# EAGLE design RaspiComm_v3 (EAGLE 6.2)
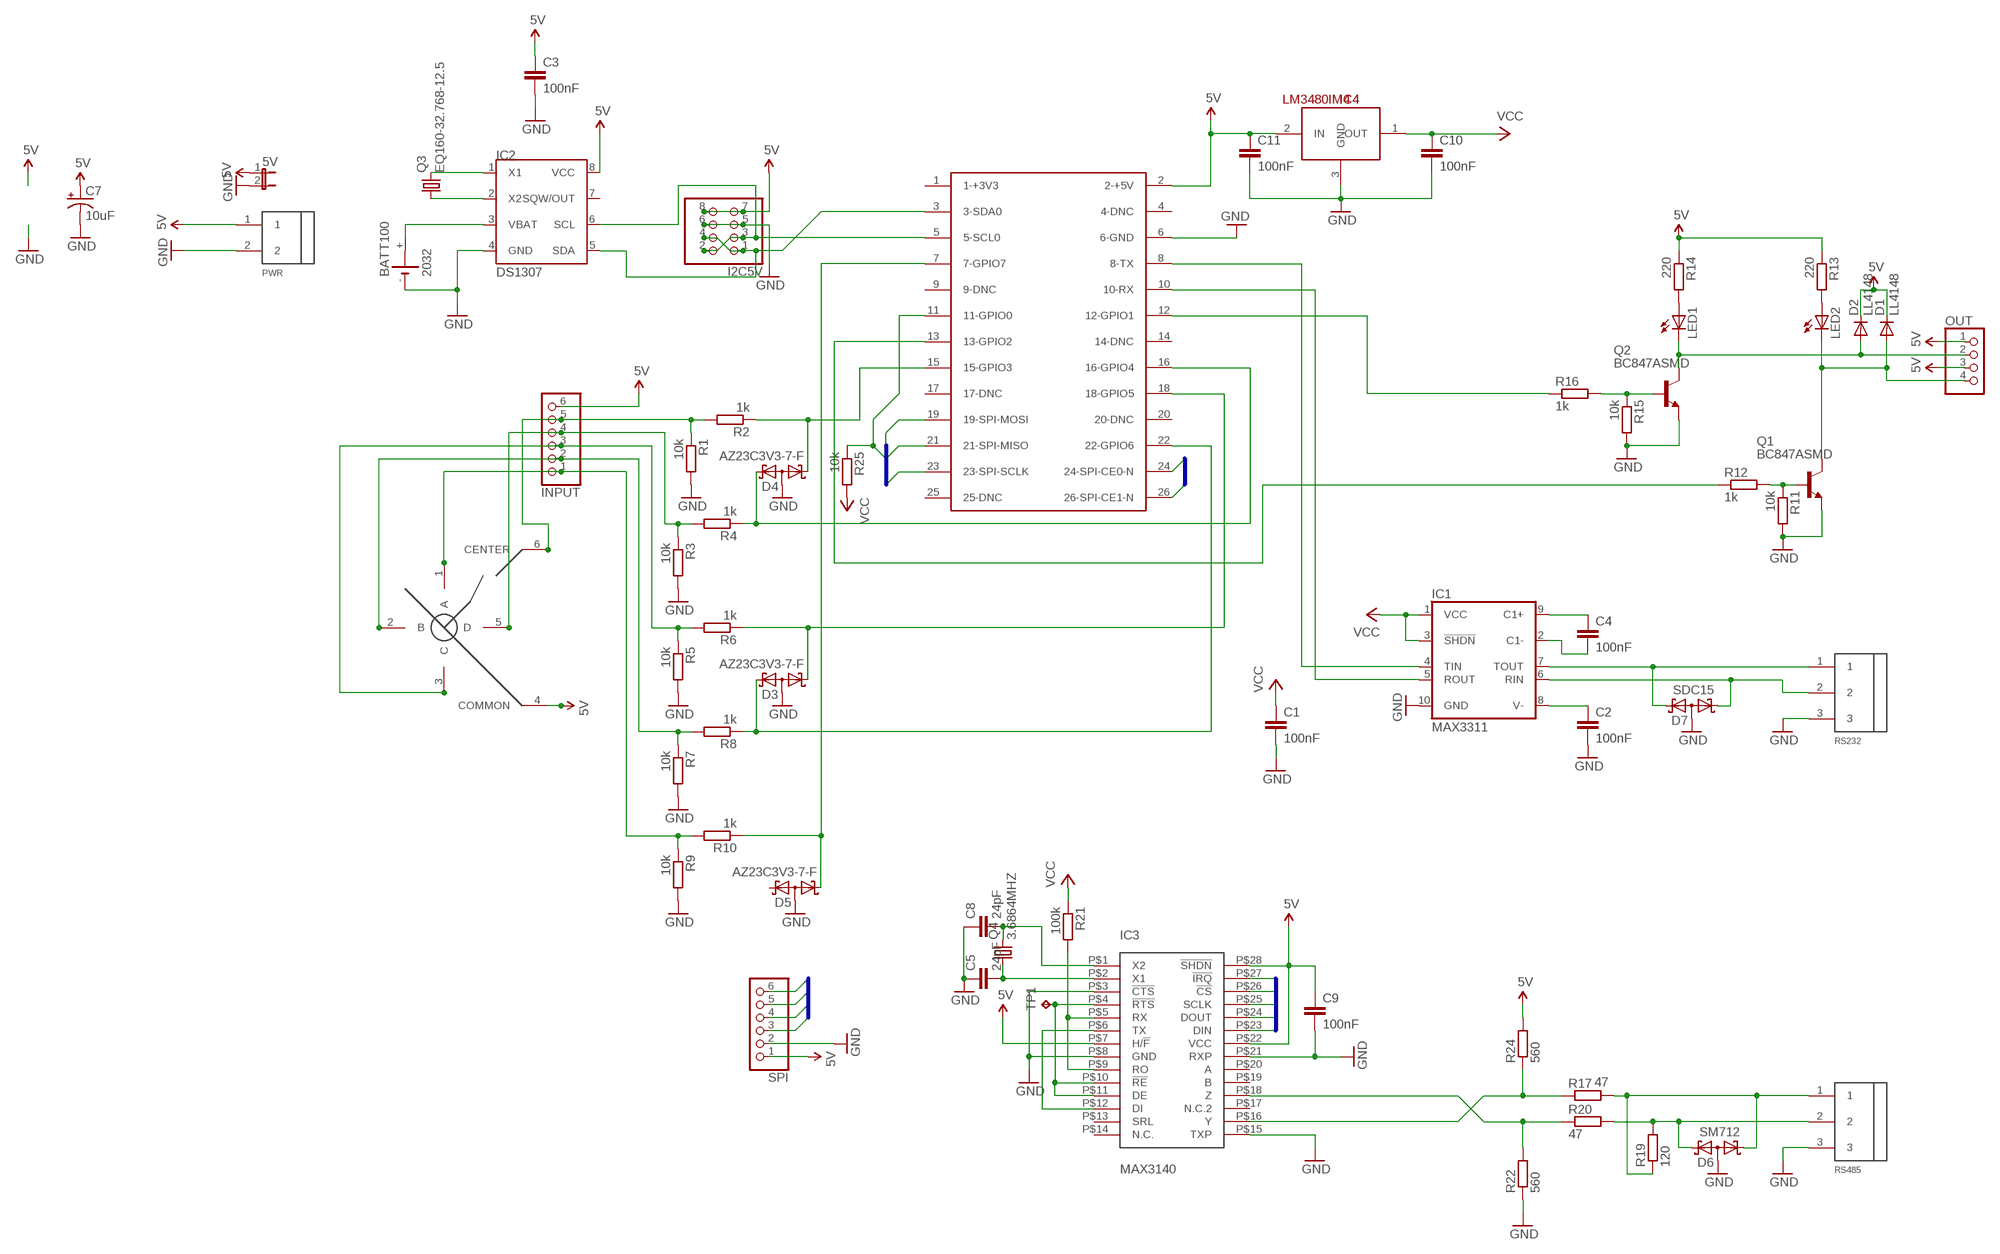
[diagram p0: schematic, sheet 1]

## Parts
5V  JP1E  [JP1]
BATT100  2032  [KZH20SMD]
C1  100nF  C-EUC0603  [C0603]
C2  100nF  C-EUC0603  [C0603]
C3  100nF  C-EUC0603  [C0603]
C4  100nF  C-EUC0603  [C0603]
C5  24pF  C-EUC0603  [C0603]
C7  10uF  293DB  [B(3528-21)]
C8  24pF  C-EUC0603  [C0603]
C9  100nF  C-EUC0603  [C0603]
C10  100nF  C-EUC0603  [C0603]
C11  100nF  C-EUC0603  [C0603]
D1  LL4148  DIODE-SOD80C  [SOD80C]
D2  LL4148  DIODE-SOD80C  [SOD80C]
D3  AZ23C3V3-7-F  AZ23CXXX  [SOT23]
D4  AZ23C3V3-7-F  AZ23CXXX  [SOT23]
D5  AZ23C3V3-7-F  AZ23CXXX  [SOT23]
D6  SM712  AZ23CXXX  [SOT23]
D7  SDC15  AZ23CXXX  [SOT23]
I2C5V  PINHD-2X4_2.54-SMD  [2X04SMD]
IC1  MAX3311  [UMAX10]
IC2  DS1307  [SOIC-8]
IC3  MAX3140  [QSOP28]
IC4  LM3480IM4  [SOT23-3]
INPUT  PINHD-1X6_2.00  [1X06M]
LED1  LEDSML0805  [SML0805]
LED2  LEDSML0805  [SML0805]
OUT  PINHD-1X4_2.00  [1X04M]
PWR  31182102  [31182102]
Q1  BC847ASMD  [SOT23]
Q2  BC847ASMD  [SOT23]
Q3  EQ160-32.768-12.5  EQ160  [EQ160]
Q4  3.6864MHZ  QUARTZ49USMX  [49USMX]
R1  10k  R-EU_R0603  [R0603]
R2  1k  R-EU_R0603  [R0603]
R3  10k  R-EU_R0603  [R0603]
R4  1k  R-EU_R0603  [R0603]
R5  10k  R-EU_R0603  [R0603]
R6  1k  R-EU_R0603  [R0603]
R7  10k  R-EU_R0603  [R0603]
R8  1k  R-EU_R0603  [R0603]
R9  10k  R-EU_R0603  [R0603]
R10  1k  R-EU_R0603  [R0603]
R11  10k  R-EU_R0603  [R0603]
R12  1k  R-EU_R0603  [R0603]
R13  220  R-EU_R0603  [R0603]
R14  220  R-EU_R0603  [R0603]
R15  10k  R-EU_R0603  [R0603]
R16  1k  R-EU_R0603  [R0603]
R17  47  R-EU_R1206  [R1206]
R19  120  R-EU_R1206  [R1206]
R20  47  R-EU_R1206  [R1206]
R21  100k  R-EU_R0603  [R0603]
R22  560  R-EU_R0603  [R0603]
R24  560  R-EU_R0603  [R0603]
R25  10k  R-EU_R0603  [R0603]
RS232  31182103  [31182103]
RS485  31182103  [31182103]
SPI  PINHD-1X6_2.00  [1X06M]
SW1  SKQUDBE010  SKQUSMD  [SKQU-SMD]
TP1  TPB1,27  [B1,27]
U$7  RASPBERRY-PIHEADER  [RASPI_GPIO_HEADER]

## Nets
5V: 5V.1 C3.1 C7.+ C9.1 C11.1 D1.C D2.C I2C5V.7 I2C5V.8 IC2.8(VCC) IC3.P$7(H/!F) IC3.P$22(VCC) IC3.P$28(!SHDN) IC4.2(IN) INPUT.6 OUT.1 OUT.3 PWR.1 R13.1 R14.1 R24.2 SPI.1 SW1.4(COMMON) U$7.2(2-+5V)
CS1: IC3.P$26(!CS) U$7.24(24-SPI-CE0-N)
CS2: SPI.3 U$7.26(26-SPI-CE1-N)
GND: 5V.2 BATT100.- C1.2 C2.2 C3.2 C5.1 C7.- C8.1 C9.2 C10.2 C11.2 D3.3(AA) D4.3(AA) D5.3(AA) D6.3(AA) D7.3(AA) I2C5V.5 I2C5V.6 IC1.10(GND) IC2.4(GND) IC3.P$3(!CTS) IC3.P$8(GND) IC3.P$15(TXP) IC3.P$21(RXP) IC4.3(GND) PWR.2 Q1.2(E) Q2.2(E) R1.2 R3.2 R5.2 R7.2 R9.2 R11.2 R15.2 R22.1 RS232.3 RS485.3 SPI.2 U$7.6(6-GND)
IRQ: IC3.P$27(!IRQ) R25.1 U$7.11(11-GPIO0)
MISO: IC3.P$24(DOUT) SPI.5 U$7.21(21-SPI-MISO)
MOSI: IC3.P$23(DIN) SPI.6 U$7.19(19-SPI-MOSI)
N$1: R16.1 U$7.12(12-GPIO1)
N$2: C5.2 IC3.P$2(X1) Q4.P$1
N$3: IC3.P$5(RX) IC3.P$9(RO) R21.2
N$4: IC2.1(X1) Q3.P$2
N$5: IC3.P$16(Y) R17.1 R24.1
N$6: IC3.P$18(Z) R20.1 R22.2
N$7: I2C5V.2 I2C5V.3 IC2.6(SCL) U$7.5(5-SCL0)
N$8: INPUT.5 R1.1 R2.2 SW1.6(CENTER)
N$9: IC3.P$4(!RTS) IC3.P$10(!RE) IC3.P$11(DE) TP1.TP
N$10: INPUT.4 R3.1 R4.2 SW1.5(D)
N$13: INPUT.3 R5.1 R6.2 SW1.3(C)
N$14: INPUT.2 R7.1 R8.2 SW1.2(B)
N$15: INPUT.1 R9.1 R10.2 SW1.1(A)
N$16: D4.1(K1) R2.1 U$7.15(15-GPIO3)
N$17: D4.2(K2) R4.1 U$7.16(16-GPIO4)
N$18: D3.1(K1) R6.1 U$7.18(18-GPIO5)
N$19: D3.2(K2) R8.1 U$7.22(22-GPIO6)
N$20: D5.1(K1) R10.1 U$7.7(7-GPIO7)
N$21: D6.2(K2) R19.2 R20.2 RS485.2
N$22: C2.1 IC1.8(V-)
N$23: C4.2 IC1.2(C1-)
N$24: C4.1 IC1.9(C1+)
N$25: D6.1(K1) R17.2 R19.1 RS485.1
N$27: LED1.A R14.2
N$28: D7.2(K2) IC1.7(TOUT) RS232.1
N$29: D7.1(K1) IC1.6(RIN) RS232.2
N$30: C8.2 IC3.P$1(X2) Q4.P$2
N$31: LED2.A R13.2
N$32: D1.A LED2.C OUT.4 Q1.3(C)
N$33: I2C5V.1 I2C5V.4 IC2.5(SDA) U$7.3(3-SDA0)
N$34: D2.A LED1.C OUT.2 Q2.3(C)
N$35: IC2.2(X2) Q3.P$1
N$37: Q2.1(B) R15.1 R16.2
N$38: Q1.1(B) R11.1 R12.2
N$39: BATT100.+ IC2.3(VBAT)
N$40: IC3.P$6(TX) IC3.P$12(DI)
N$41: R12.1 U$7.13(13-GPIO2)
RX: IC1.5(ROUT) U$7.10(10-RX)
SCLK: IC3.P$25(SCLK) SPI.4 U$7.23(23-SPI-SCLK)
TX: IC1.4(TIN) U$7.8(8-TX)
VCC: C1.1 C10.1 IC1.1(VCC) IC1.3(!SHDN) IC4.1(OUT) R21.1 R25.2
Unconnected: D5.2(K2) IC2.7(SQW/OUT) IC3.P$13(SRL) IC3.P$14(N.C.) IC3.P$17(N.C.2) IC3.P$19(B) IC3.P$20(A) U$7.1(1-+3V3) U$7.4(4-DNC) U$7.9(9-DNC) U$7.14(14-DNC) U$7.17(17-DNC) U$7.20(20-DNC) U$7.25(25-DNC)

## Buses
SPI:IRQ,CS1,CS2,SCLK,MISO,MOSI

## Library data of the parts
5V = jumper:JP1E: JUMPER
BATT100 = kzh20_lithium_batterie_holder:2032
C1-C5 C8-C11 = rcl:C-EU: CAPACITOR, European symbol
C7 = vishay:293D
D1 D2 = diode:DIODE-: DIODE
D3-D7 = diode:AZ23CXXX: Dual-Zener Diode
I2C5V = pinhead:PINHD-2X4: PIN HEADER
IC1 = maxim:MAX3311: 460kbps, 1µA Supply Current, RS-232-Compatible Transceivers in µMAX Source: http://www.maxim-ic.com .. MAX3311-MAX3313.pdf; MF: MAXIM; MPN: MAX3311ECUB+; OC_FARNELL: 1379937; OC_NEWARK: 67K4953
IC2 = dallas:DS1307: I2C Serial RTC w/56 bytes battery backed RAM
IC3 = max3140:MAX3140
IC4 = SparkFun:LM3480IM4
INPUT SPI = pinhead:PINHD-1X6: PIN HEADER
LED1 LED2 = led:LED: LED OSRAM: - CHIPLED LG R971, LG N971, LY N971, LG Q971, LY Q971, LO R971, LY R971 LH N974, LH R974 LS Q976, LO Q976, LY Q976 LO Q996 - Hyper CHIPLED LW Q18S LB Q993, LB Q99A, LB R99A - SideLED LS A670, LO A670, LY A670, LG A670, LP A670 LB A673, LV A673, LT A673, LW A673 LH A674 LY A675 LS A676, LA A676, LO A676, LY A676, LW A676 LS A679, LY A679, LG A679 - Hyper Micro SIDELED® LS Y876, LA Y876, LO Y876, LY Y876 LT Y87S - SmartLED LW L88C, LW L88S LB L89C, LB L89S, LG L890 LS L89K, LO L89K, LY L89K LS L896, LA L896, LO L896, LY L896 - TOPLED LS T670, LO T670, LY T670, LG T670, LP T670 LSG T670, LSP T670, LSY T670, LOP T670, LYG T670 LG T671, LOG T671, LSG T671 LB T673, LV T673, LT T673, LW T673 LH T674 LS T676, LA T676, LO T676, LY T676, LB T676, LH T676, LSB T676, LW T676 LB T67C, LV T67C, LT T67C, LS T67K, LO T67K, LY T67K, LW E67C LS E67B, LA E67B, LO E67B, LY E67B, LB E67C, LV E67C, LT E67C LW T67C LS T679, LY T679, LG T679 LS T770, LO T770, LY T770, LG T770, LP T770 LB T773, LV T773, LT T773, LW T773 LH T774 LS E675, LA E675, LY E675, LS T675 LS T776, LA T776, LO T776, LY T776, LB T776 LHGB T686 LT T68C, LB T68C - Hyper Mini TOPLED® LB M676 - Mini TOPLED Santana® LG M470 LS M47K, LO M47K, LY M47K Source: http://www.osram.convergy.de LUXEON: - LUMILED® LXK2-PW12-R00, LXK2-PW12-S00, LXK2-PW14-U00, LXK2-PW14-V00 LXK2-PM12-R00, LXK2-PM12-S00, LXK2-PM14-U00 LXK2-PE12-Q00, LXK2-PE12-R00, LXK2-PE12-S00, LXK2-PE14-T00, LXK2-PE14-U00 LXK2-PB12-K00, LXK2-PB12-L00, LXK2-PB12-M00, LXK2-PB14-N00, LXK2-PB14-P00, LXK2-PB14-Q00 LXK2-PR12-L00, LXK2-PR12-M00, LXK2-PR14-Q00, LXK2-PR14-R00 LXK2-PD12-Q00, LXK2-PD12-R00, LXK2-PD12-S00 LXK2-PH12-R00, LXK2-PH12-S00 LXK2-PL12-P00, LXK2-PL12-Q00, LXK2-PL12-R00 Source: www.luxeon.com KINGBRIGHT: KA-3528ASYC Source: www.kingbright.com
OUT = pinhead:PINHD-1X4: PIN HEADER
PWR = ria:31182102
Q1 Q2 = transistor-npn:BC847*: NPN Transistor
Q3 = EuroQuartz:EQ160
Q4 = EuroQuartz:QUARTZ
R1-R17 R19-R22 R24 R25 = rcl:R-EU_: RESISTOR, European symbol
RS232 RS485 = ria:31182103
SW1 = alps:SKQU
TP1 = testpad:TP: Test pad
U$7 = RaspberryPi:RASPBERRY-PI: Raspberry Pi Board <http://www.raspberrypi.org/> Jacques Lagnel V1.0 (beta) 2012 Board dimension: Forum 3D model <http://www.raspberrypi.org/forum/general-discussion/mechanical-profile-3d-models?value=3d%20model&type=1&include=1&search=1&ret=all> The GPIO Connector (P1): http://elinux.org/RPi_Low-level_peripherals

## Board
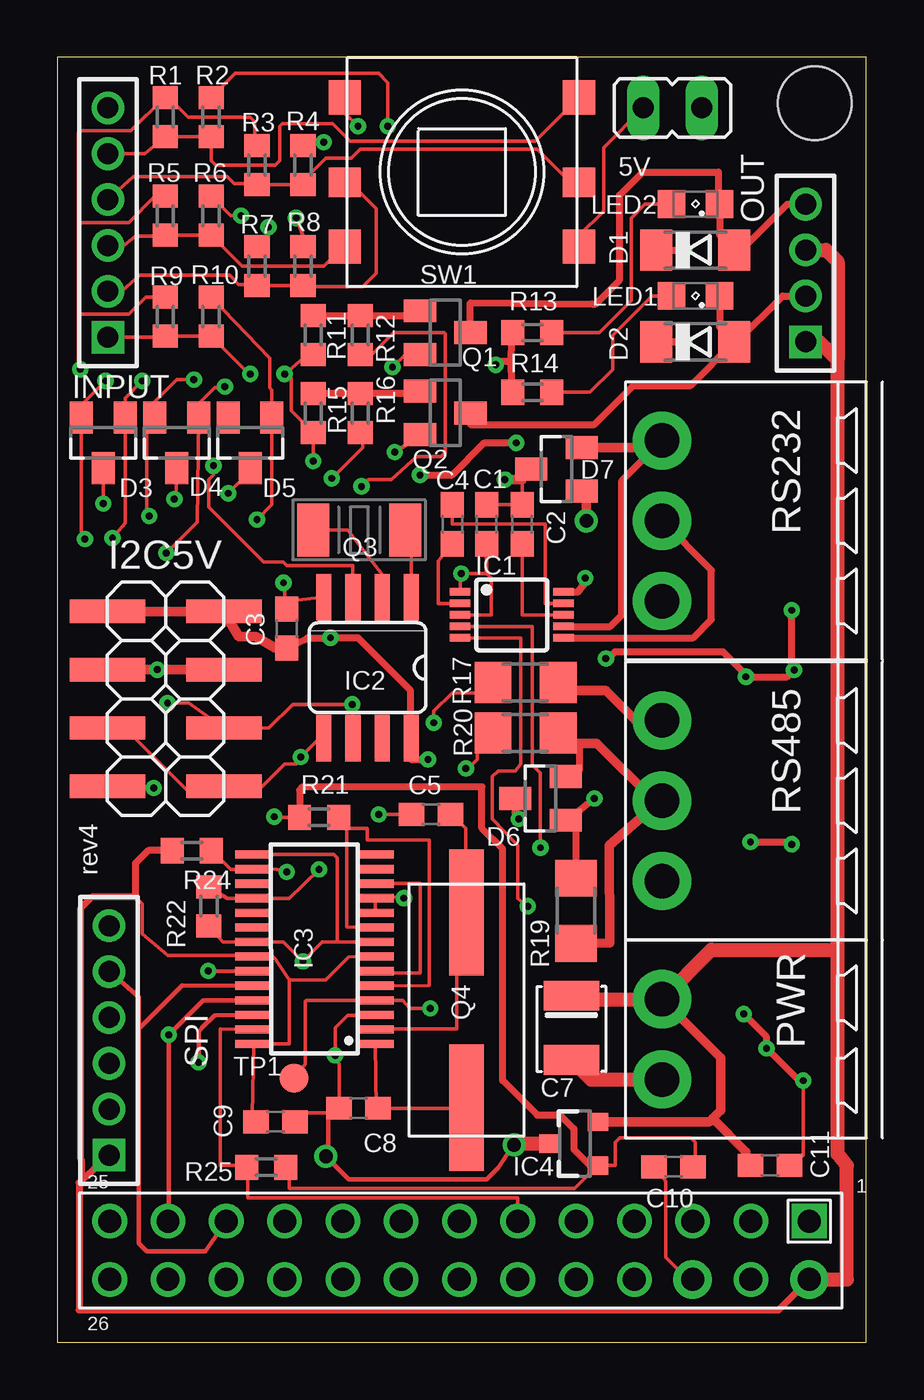
[diagram p1: board, top side]
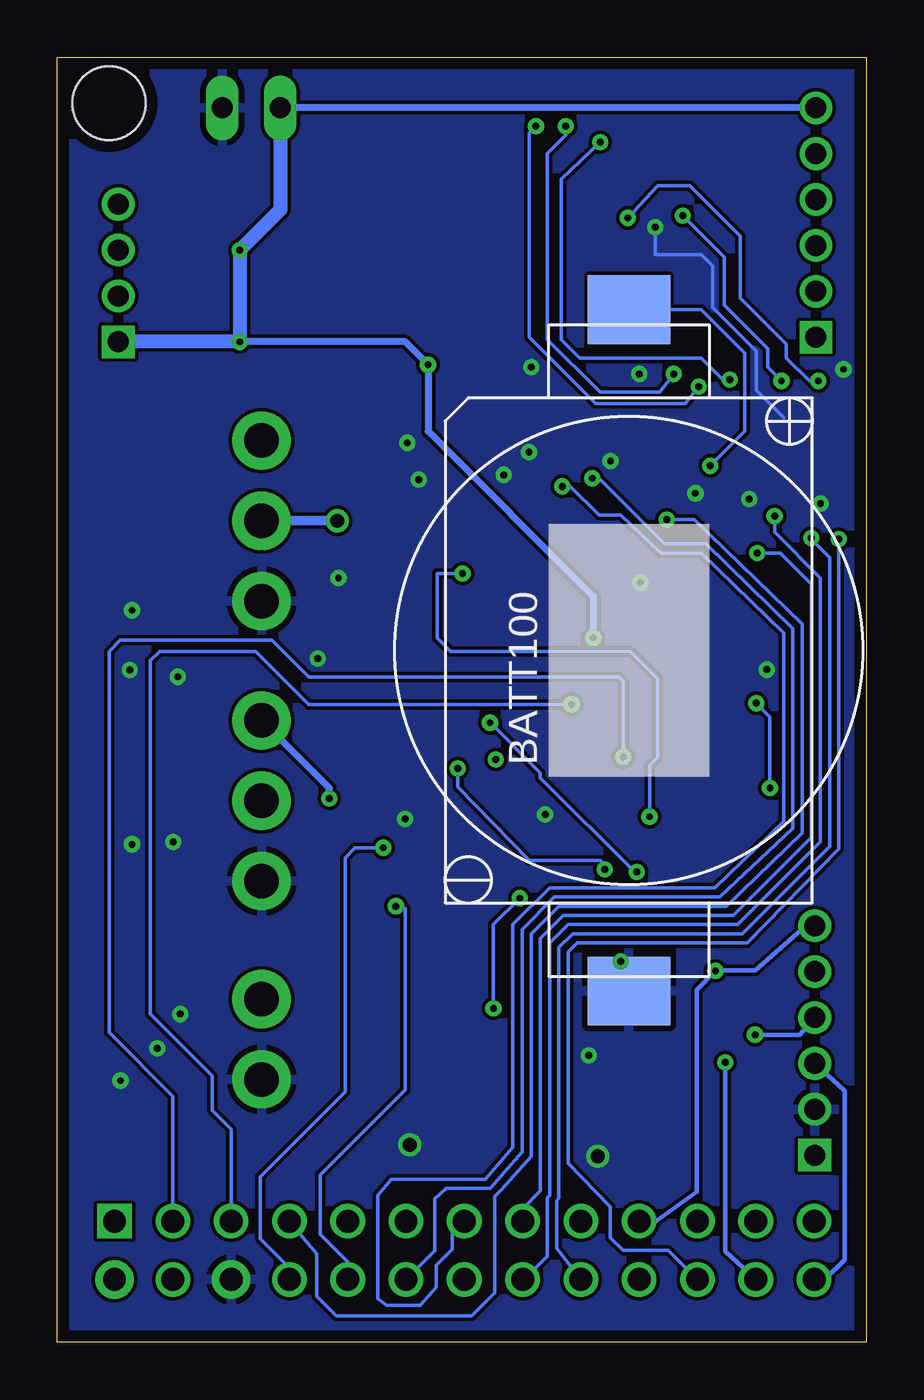
[diagram p2: board, bottom side, seen from below]

Size 35.25 x 56 mm. Coordinates in mm from the lower left corner, seen from the top.
Outline: 0,0 35.25,0 35.25,56 0,56 0,0
Copper layers (1*16): Top 0.035mm / dielectric 1.5mm / Bottom 0.035mm
Design rules: minimum track width 6mil, minimum drill 11mil, track to track 6mil, track to pad 6mil, pad to pad 6mil, via to via 6mil, smd to smd 0mil, copper to edge 20mil, drill to drill 8mil, minimum pad ring 10mil, minimum via ring 8mil, stop-mask expansion 4mil, vias tented up to drill 0mil, thermal gap 10mil
Holes 3.2 mm at 33,54

### Footprints (pad centres in the part's own frame; a part is rotated, then mirrored left to right if it is on the bottom)
JP1 = drill 0.914 long: 1 0,-1.27; 2 0,1.27
KZH20SMD = smd 3 x 3.6: + 14.85,0; - -14.85,0
C0603 = smd 1.1 x 1: 1 -0.85,0; 2 0.85,0
B(3528-21) = smd 1.3 x 2.4: + 1.4,0; - -1.4,0
SOD80C = smd 1.4 x 1.8: A 1.7,0; C -1.7,0
SOT23 = smd 1 x 1.4: 1 -0.95,-1.1; 2 0.95,-1.1; 3 0,1.1
2X04SMD = smd 1.016 x 3.302: 1 -1.27,-3.81; 2 -1.27,1.27; 3 1.27,-3.81; 4 1.27,1.27; 5 3.81,-3.81; 6 3.81,1.27; 7 6.35,-3.81; 8 6.35,1.27
UMAX10 = smd 0.32 x 0.9: 1 -1,-2.25; 2 -0.5,-2.25; 3 0,-2.25; 4 0.5,-2.25; 5 1,-2.25; 6 1,2.25; 7 0.5,2.25; 8 0,2.25; 9 -0.5,2.25; 10 -1,2.25
SOIC-8 = smd 2.032 x 0.66: 1 -3.073,1.27; 2 -3.073,0; 3 -3.073,-1.27; 4 -3.073,-2.54; 5 3.073,-2.54; 6 3.073,-1.27; 7 3.073,0; 8 3.073,1.27
QSOP28 = smd 0.356 x 1.6: P$1 -4.128,-2.655; P$2 -3.493,-2.655; P$3 -2.857,-2.655; P$4 -2.223,-2.655; P$5 -1.587,-2.655; P$6 -0.953,-2.655; P$7 -0.318,-2.655; P$8 0.318,-2.655; P$9 0.953,-2.655; P$10 1.587,-2.655; P$11 2.223,-2.655; P$12 2.857,-2.655; P$13 3.493,-2.655; P$14 4.128,-2.655; P$15 4.128,2.655; P$16 3.493,2.655; P$17 2.857,2.655; P$18 2.223,2.655; P$19 1.587,2.655; P$20 0.953,2.655; P$21 0.318,2.655; P$22 -0.318,2.655; P$23 -0.953,2.655; P$24 -1.587,2.655; P$25 -2.223,2.655; P$26 -2.857,2.655; P$27 -3.493,2.655; P$28 -4.128,2.655
SOT23-3 = smd 0.8 x 0.9: 1 -0.95,-1; 2 0.95,-1; 3 0,1.1
1X06M = drill 0.914 square: 1 -5,0 | drill 0.914: 2 -3,0; 3 -1,0; 4 1,0; 5 3,0; 6 5,0
SML0805 = smd 1.2 x 1.2: A 1.05,0; C -1.05,0
1X04M = drill 0.914 square: 1 -3,0 | drill 0.914: 2 -1,0; 3 1,0; 4 3,0
31182102 = drill 1.5 pad 2.54: 1 -1.75,-3.65; 2 1.75,-3.65
EQ160 = smd 1.4 x 2.3: P$1 -2,0; P$2 2,0
49USMX = smd 5.5 x 1.5: P$1 -4.25,0; P$2 4.25,0
R0603 = smd 1 x 1.1: 1 -0.85,0; 2 0.85,0
R1206 = smd 1.6 x 1.803: 1 -1.422,0; 2 1.422,0
31182103 = drill 1.5 pad 2.54: 1 -3.5,-3.65; 2 0,-3.65; 3 3.5,-3.65
SKQU-SMD = smd 1.4 x 1.5: 1 -5.1,3.25; 3 -5.1,-3.25; 4 5.1,-3.25; 6 5.1,3.25 | smd 1.4 x 1.3: 2 -5.1,-0.45; 5 5.1,-0.45
B1,27 = smd 1.27 x 1.27: TP 0,0
RASPI_GPIO_HEADER = drill 1 square: 1 -16.51,-1.27 | drill 1 pad 1.676: 2 -16.51,1.27; 6 -11.43,1.27 | drill 1: 3 -13.97,-1.27; 4 -13.97,1.27; 5 -11.43,-1.27; 7 -8.89,-1.27; 8 -8.89,1.27; 9 -6.35,-1.27; 10 -6.35,1.27; 11 -3.81,-1.27; 12 -3.81,1.27; 13 -1.27,-1.27; 14 -1.27,1.27; 15 1.27,-1.27; 16 1.27,1.27; 17 3.81,-1.27; 18 3.81,1.27; 19 6.35,-1.27; 20 6.35,1.27; 21 8.89,-1.27; 22 8.89,1.27; 23 11.43,-1.27; 24 11.43,1.27; 25 13.97,-1.27; 26 13.97,1.27

### Placement (x,y rotation side)
5V  26.8,53.8 270 top
BATT100  10.35,30.15 90 bottom
C1  18.7,35.65 90 top
C2  20.25,35.65 90 top
C3  10,31.1 90 top
C4  17.2,35.65 270 top
C5  16.27,23 0 top
C7  22.4,13.7 90 top
C8  13.12,10.2 0 top
C9  9.5,9.6 0 top
C10  26.85,7.65 180 top
C11  31.05,7.7 0 top
D1  27.8,47.6 0 top
D2  27.8,43.6 0 top
D3  2,39.2 180 top
D4  5.2,39.2 180 top
D5  8.4,39.2 180 top
D6  21.05,23.7 90 top
D7  21.75,38.05 90 top
I2C5V  3.45,25.5 90 top
IC1  19.8,31.7 270 top
IC2  14.15,29.4 270 top
IC3  11.2,17.12 90 top
IC4  22.55,8.65 90 top
INPUT  2.2,48.8 90 top
LED1  27.8,45.6 180 top
LED2  27.8,49.6 180 top
OUT  32.6,46.6 90 top
PWR  30,13.2 270 top
Q1  16.9,44 270 top
Q2  16.9,40.5 270 top
Q3  13.15,35.4 0 top
Q4  17.82,14.47 270 top
R1  4.7,53.4 90 top
R2  6.7,53.4 270 top
R3  8.7,51.3 90 top
R4  10.7,51.3 270 top
R5  4.7,49.1 90 top
R6  6.7,49.1 270 top
R7  8.7,46.9 90 top
R8  10.7,46.9 270 top
R9  4.7,44.7 90 top
R10  6.7,44.7 270 top
R11  11.15,43.9 270 top
R12  13.2,43.9 90 top
R13  20.7,44 0 top
R14  20.7,41.4 0 top
R15  11.15,40.5 270 top
R16  13.2,40.5 90 top
R17  20.4,28.75 0 top
R19  22.6,18.8 270 top
R20  20.4,26.55 0 top
R21  11.4,22.88 0 top
R22  6.6,19 90 top
R24  5.85,21.43 180 top
R25  9.1,7.62 0 top
RS232  30,35.8 270 top
RS485  30,23.6 270 top
SPI  2.25,13.15 90 top
SW1  17.62,51 0 top
TP1  10.3,11.5 0 top
U$7  16.25,4 180 top

### Tracks (layer width: path | path; a pad name or v marks a point on that pad's centre or on a via)
5V  (via drill 0.3)
  Top 0.153: 10.1,15.8 9.5,16.7 9.4,16.8 IC3.P$22 7.8,16.85 4.8,16.85 3.7,17.8 3.7,19.1 3.4,19.4 | 10.1,15.8 10.1,13 IC3.P$28 8.5,9.9 8.65,9.75 C9.1 | IC3.P$7 12.7,16.8 11.7,15.8 10.1,15.8 | SW1.4 22.73,48.23 23.8,49.3 23.8,52.07 5V.1 | 1,8 1.04,7.96 | C11.1 30,7.75
  Top 0.305: C3.1 10.9,30.7 v11.9,30.7 13.1,30.7 15.37,28.43 15.37,26.38 IC2.8 15.42,25.38 15.6,25.4 v16.15,25.4 | R14.1 19.75,42.74 | 19.75,42.74 R13.1 | SPI.1 1.04,7.03 | 1.04,7.03 0.95,6.95 0.95,1.4 31.43,1.4 U$7.2 | D1.C v27.3,47.6 | 19.75,42.74 19.24,42.74 v19.1,42.6 | D2.C v27.3,43.6 | 1,8 1,18.9 1.5,19.4 3.4,19.4 3.4,20.88 3.95,21.43 R24.2 | 1.04,7.96 1.04,7.03
  Top 0.406: I2C5V.8 I2C5V.7 7.91,30.75 8.65,30.75 9.5,30.25 C3.1 | IC4.2 28.4,9.6 28.55,9.75 | 28.55,9.75 28.9,10.1 28.9,12.4 PWR.1 | 30,7.75 30,8.3 28.55,9.75
  Top 0.61: U$7.2 34.4,2.73 34.4,7.7 34,8.2 34,17.1 | 34,17.1 34,42.8 | 34,42.8 33.2,43.6 OUT.1 | OUT.3 33.5,47.6 34,47.1 34,42.8 | 34,17.1 28.5,17.1 PWR.1 22.55,14.95 C7.+
  Bottom 0.305: INPUT.6 5V.1 | v16.15,25.4 16.15,25.45 | v11.9,30.7 11.9,32.5 19.1,39.7 v19.1,42.6 20.1,43.6 v27.3,43.6
  Bottom 0.61: OUT.1 v27.3,43.6 v27.3,47.6 25.53,49.37 5V.1
CS1  (via drill 0.3)
  Top 0.2: IC3.P$26 6.85,14.25 6.3,13.7 6.15,13.5 v6.15,12.2
  Bottom 0.2: v6.15,12.2 6.15,3.96 U$7.24
CS2
  Bottom 0.2: SPI.3 0.95,10.95 0.95,3.6 1.82,2.73 U$7.26
GND  (via drill 0.3, 0.6)
  Top 0.153: C5.1 v14,23 | 8.5,17.5 IC3.P$21 | R11.2 11.2,43.3 v9.9,42.2 10,42.1 10.2,42 10.2,40.6 R15.2 v11.15,38.4 | Q2.2 15.8,39.5 v14.7,38.8 | Q1.2 15.15,43.05 v14.6,42.5 | IC3.P$3 arc-90 13.84,14.25 12.65,14.25 12.1,13.7 v12.1,12.5 12.12,12.47 12.1,12.3 12.28,12.12 C8.1 12.12,10 11.9,10 | 10.5,9.9 C9.2 10.5,10 11.8,10 | C3.2 9.9,32.25 | 9.9,32.25 9.74,32.25 IC2.4 | 9.9,32.25 9.9,33.15 v9.85,33.1 | D3.3 v2,36.55 | D4.3 5.15,36.8 v5.1,36.75 | D5.3 8.4,37.95 v7.45,37 | IC3.P$8 12.2,17.45 | 12.2,17.45 11.55,17.45 v10.7,16.6 9.85,17.45 IC3.P$21 | R5.2 4.25,49.95 3.1,48.8 0.9,48.8 | R9.2 3.85,45.55 3.1,44.8 0.9,44.8 | 0.9,44.8 0.9,48.8 | 0.9,48.8 0.9,52.7 1,52.8 3.2,52.8 4.65,54.25 R1.2 4.85,54.25 5.7,53.4 8.4,53.4 8.6,53.2 8.6,52.25 R3.2 | 0.9,44.8 0.9,42.5 v1,42.4 | C1.2 C2.2 20.25,37.6 | R7.2 9.2,48.25 v9.2,48.6 | IC3.P$15 9.45,21.25 arc-90 9.45,21.25 12.05,21.25 12.2,21.1 12.2,17.45 | R22.1 7.2,17.45 IC3.P$21 | C10.2 26.5,7 26.5,3.7 27.47,2.73 U$7.6 | C11.2 32.5,8.15 v32.5,11.4
  Top 0.2: 19.6,8.7 v19.9,8.6 19.8,8.5 19.2,7.6 18.7,7.1 12.7,7.1 v11.7,8.1 11.8,8.1 11.8,10 11.9,10
  Top 0.305: v30,29 30.1,29 | 30.1,29 31.8,29 v32.1,29.3 32,29.3 v32,31.9 | v30.2,21.8 31.9,21.8 v32,21.7 | v32.5,11.4 32.3,11.4 v30.9,12.8 30.9,13.3 v29.9,14.3 | v15.8,37.8 17.2,37.8 18.6,39.2 v20,39.2 | v23.9,29.8 24,29.8 24.3,30.1 29,30.1 30.1,29 | IC1.10 22.7,32.7 23,33.1 v23,33.3 | 19.95,24 D6.3 19.95,23.1 v20.1,22.8
  Top 0.406: I2C5V.6 v4.35,29.31 4.66,29.31 4.7,29.35 4.74,29.31 I2C5V.5 | v19.5,37.6 20.25,37.6 20.25,38.05 D7.3
  Top 0.61: C7.- 23.25,11.45 PWR.2 | IC4.3 19.95,8.65 v19.9,8.6
  Bottom 0.153: v14,23 14,23.2 | v14.6,42.5 14.4,42.5 | v12.1,12.5 12.1,12.3 | v2,36.55 1.9,36.35 | v5.1,36.75 5.1,36.6 | v7.45,37 7.45,36.9 7.35,36.8 | v10.7,16.6 10.6,16.6 10.5,16.5 10.5,15.65 BATT100.- | v1,42.4 1,42.3 | v9.2,48.6 9.2,47.4 7.2,47.4 6.7,46.9 6.7,45.1 4.8,43.2 4.8,41.5 3.6,40.3
  Bottom 0.305: v23,33.3 22.9,33.3 | v20.1,22.8 20.2,22.7
  Bottom 0.406: v4.35,29.31 4.35,29.5
  pour Bottom: 0,56 35.25,56 35.25,0 0,0
IRQ
  Top 0.153: IC3.P$27 7.1,13.65 7.1,7.7 8.25,7.7 R25.1 8.3,7.92 8.3,6.3 20.06,6.3 U$7.11
MISO
  Top 0.152: 3.55,13.6 3.55,13.65
  Top 0.2: IC3.P$24 5.45,15.55 3.55,13.65 | U$7.21 7.02,4.77 6.45,3.95 3.9,3.95 3.55,4.3 3.55,13.6 3.55,15.05 SPI.5
MOSI  (via drill 0.3)
  Top 0.153: 6.6,16.15 v6.58,16.18
  Top 0.2: IC3.P$23 6.6,16.15
  Bottom 0.153: 6.58,16.2 v6.58,16.18
  Bottom 0.2: U$7.19 9.18,5.27 7.4,6.55 7.4,15.35 v6.58,16.18 | SPI.6 2.65,18.15 4.85,16.2 6.58,16.2
N$1  (via drill 0.3)
  Top 0.153: R16.1 13.25,39.65 13.3,39.6 13.3,39 v11.95,37.65
  Bottom 0.153: v11.95,37.65 11.65,37.65 8.8,34.8 7,34.8 3.2,31.1 3.2,22.4 6.4,19.4 13.6,19.4 15,18 15,8.3 16.4,6.7 18.3,6.7 18.8,6.25 18.8,3.99 U$7.12
N$2
  Top 0.153: IC3.P$2 13.9,13.65 17.4,13.65 17.4,18.73 Q4.P$1 17.8,22.4 17.43,22.77 17.43,23.3 C5.2
N$3
  Top 0.153: R21.2 12.6,23.27 12.6,22.4 | 12.6,22.4 12.6,18.1 IC3.P$9 | IC3.P$5 16.2,15.55 16.2,21.9 13.5,21.9 13.5,22.4 12.6,22.4
N$4
  Top 0.153: IC2.1 15.42,35.27 Q3.P$2
N$5  (via drill 0.3)
  Top 0.153: v10,20.5 9.55,20.6 IC3.P$16 8.53,20.6 7.55,20.6 6.72,21.43 R24.1 | v16.4,27 16.4,27.5 17.2,28.3 18.88,28.3 R17.1
  Bottom 0.153: v10,20.5 10.1,20.5 14.2,24.6 14.2,24.8 v16.4,27
N$6  (via drill 0.3)
  Top 0.153: v11.4,20.6 10.1,19.35 IC3.P$18 7.4,19.35 R22.2 | v17.8,25 17.9,25 18.3,25.4 18.28,26.8 R20.1
  Bottom 0.153: v11.4,20.6 11.4,20.8 11.6,21 14.7,21 17.8,24.2 v17.8,25 17.8,24.9
N$7  (via drill 0.3)
  Top 0.153: IC2.6 12.88,27.47 v12.85,27.8 10.25,27.8 9.22,26.77 I2C5V.3 5.73,27.85 v4.8,27.85 | I2C5V.2 4.12,24.23 v4.2,24.15
  Bottom 0.153: U$7.5 27.68,9.28 28.5,10.1 28.5,11.6 31.2,14.3 31.2,29.7 30.8,30.1 26.6,30.1 24.3,27.8 v12.85,27.8 | v4.2,24.15 4.2,27.25 v4.8,27.85
N$8
  Top 0.153: 22.77,54.3 SW1.6 20.82,52.35 12.75,52.35 12,53.1 9.8,53.1 9.7,53 9.7,51.5 9.5,51.3 6.9,51.3 6.7,51.5 R2.2 R1.1 3.8,51.8 INPUT.5
N$9  (via drill 0.3)
  Top 0.153: IC3.P$10 IC3.P$11 15.05,19.4 v15.1,19.35 15.3,19.15 | v16.25,14.55 15.35,14.55 15.05,14.9 IC3.P$4 10.85,14.9 arc90 10.85,14.9 10.8,14.85 10.8,12.1 10.3,11.6 TP1.TP
  Bottom 0.153: v16.25,14.55 16.25,18.2 v15.1,19.35
N$10
  Top 0.153: 23.3,50.1 23.3,50.55 SW1.5 22.35,50.55 20.9,52 13.2,52 12.8,51.6 11.7,51.6 10.7,50.6 R4.2 R3.1 8.65,50.5 7.7,50.5 7.4,50.8 3.3,50.8 INPUT.4
N$13
  Top 0.153: INPUT.3 2.9,47.8 3.4,48.2 4.65,48.2 R5.1 R6.2 8.05,46.9 11.6,46.9 12.45,47.75 SW1.3
N$14
  Top 0.153: SW1.2 12.47,50.1 13.2,50.1 13.9,49.4 13.9,46.6 13.3,46 10.75,46 R8.2 R7.1 8.65,46.1 7.9,46.1 7.5,46.5 3.6,46.5 2.8,45.8 INPUT.2
N$15  (via drill 0.3)
  Top 0.153: 12.53,54.3 SW1.1 12.53,53.58 v13.1,53 | 4.6,43.75 R9.1 | v8.4,42.2 8.35,42.2 R10.2 R9.1 | INPUT.1 4.65,43.8 R9.1
  Bottom 0.153: v13.1,53 13.1,52.6 13.9,51.8 13.9,43.7 11.6,41.4 9,41.4 v8.4,42.2
N$16  (via drill 0.3)
  Top 0.153: v7.3,41.65 7.35,41.6 6.85,41.6 6.1,40.85 D4.1 6.1,35.75 v4.75,34.4 | v14.4,53 14.4,54.9 14,55.3 7.75,55.3 R2.1
  Bottom 0.153: v4.75,34.4 3.75,34.4 2.4,33.05 2.4,22 5.8,18.6 13.2,18.6 14.2,17.6 14.2,6.6 14.98,5.82 U$7.15 | v7.3,41.65 7.9,40.9 11.8,40.9 14.7,43.8 14.7,52.7 v14.4,53
N$17  (via drill 0.3)
  Top 0.153: v5.95,41.95 5.2,41.95 4.2,40.95 D4.2 3.9,40 3.9,36.1 v4,36 | v11.6,52.3 11.05,52.5 R4.1
  Bottom 0.153: 14.9,2.86 14.96,2.69 | 14.96,2.69 U$7.16 | 14.96,2.69 13.9,3.75 13.9,6.3 13.8,6.4 13.8,17.4 13,18.2 5.6,18.2 2,21.8 2,33.3 4,35.3 v4,36 | v5.95,41.95 6.25,41.95 7.2,42.9 12.5,42.9 13.3,43.7 13.3,50.7 v11.6,52.3
N$18  (via drill 0.3)
  Top 0.153: v2.4,35.05 2.95,35.7 D3.1 2.95,41.15 v3.7,41.9 | v8,49.1 7.55,49.1 R6.1
  Bottom 0.153: v2.4,35.05 2.4,35 1.6,34.2 1.6,21.6 5.4,17.8 12.8,17.8 13.4,17.2 13.4,6.3 13.5,6.15 13.5,4.09 U$7.18 | v3.7,41.9 4.3,42.5 4.3,43.3 6.2,45.2 6.2,47.3 v8,49.1
N$19  (via drill 0.3)
  Top 0.153: v1.2,35 1.05,35.3 D3.2 1.05,40.85 v2.1,41.9 | v10.4,49 10.7,48.25 R8.1
  Bottom 0.153: v1.2,35 1.2,21.5 5.2,17.4 12.6,17.4 13,17 13,7.8 11.15,5.9 11.15,4.55 10.6,4 8.63,4 U$7.22 | v2.1,41.9 2.5,41.9 3.5,42.9 3.5,43.5 5.5,45.5 5.5,48.2 7.7,50.4 9.1,50.4 v10.4,49
N$20  (via drill 0.3)
  Top 0.153: v8.7,35.85 9.35,36.5 D5.1 9.35,41.5 9.25,41.6 9.25,42.9 R10.1
  Bottom 0.153: v8.7,35.85 7.5,35.85 2.8,31.3 2.8,22.2 6.1,19 13.4,19 14.6,17.8 14.6,8.1 15.9,6.65 16.2,6.35 16.2,2.15 17.2,1.15 23.1,1.15 23.95,2 23.95,3.86 U$7.7
N$21
  Top 0.305: 26.3,23.6 RS485.2 26,23.6 | 21.84,25.95 22,26.1 | D6.2 22.75,24.95 22.75,26.1
  Top 0.406: 21.8,25.98 21.84,25.95 R20.2 | R19.2 24.07,17.4 24.05,21.65 26.3,23.6 | 22,26.1 22.75,26.1 23.5,26.1 26,23.6
N$22
  Top 0.153: IC1.8 20.25,31.7 C2.1
N$23
  Top 0.153: C4.2 16.6,34.05 16.6,32.2 IC1.2
N$24
  Top 0.153: C4.1 17.2,35.65 21.25,35.65 21.25,32.2 IC1.9
N$25  (via drill 0.3)
  Top 0.305: 21.9,28.32 21.98,28.4 | R19.1 22.61,22.95 | 22.61,22.95 22.47,22.95 v23.4,23.7 | D6.1 22.66,23.05 22.61,22.95
  Top 0.406: 21.9,28.32 R17.2 | 21.98,28.4 23.9,28.4 25.2,27.1 RS485.1
  Bottom 0.305: v23.4,23.7 23.4,24.15 RS485.1
N$27
  Top 0.153: R14.2 23.2,41.4 24.2,42.4 24.2,43.9 25.9,45.6 LED1.A
N$28
  Top 0.305: IC1.7 24.1,31.2 24.6,31.7 24.6,37.55 RS232.1
  Top 0.406: D7.2 26.35,39 RS232.1
N$29  (via drill 0.6)
  Top 0.305: IC1.6 27.7,30.7 28.5,31.5 28.5,33.65 RS232.2
  Top 0.406: D7.1 23.05,37.1 v23.05,35.8
  Bottom 0.406: v23.05,35.8 RS232.2
N$30
  Top 0.153: IC3.P$1 13.9,10.2 C8.2 17.43,10.2 Q4.P$2
N$31
  Top 0.153: R13.2 23.6,44 25,45.4 25,49 25.6,49.6 LED2.A
N$32
  Top 0.305: Q1.3 18,45.3 23.3,45.25 23.45,45.25 24.5,46.3 24.5,50 25.5,51 28.8,51 28.8,49.65 LED2.C 28.85,48.25 D1.A 29.8,47.6 31.8,49.6 OUT.4
N$33  (via drill 0.3)
  Top 0.153: I2C5V.4 2.93,26.77 5.65,24.05 6.63,24.05 I2C5V.1 8.93,24.23 9.9,25.2 10.4,25.2 10.6,25.4 v10.6,25.5 11.43,26.33 IC2.5
  Bottom 0.153: U$7.3 30.22,10.72 33,13.5 33,30.1 32.5,30.6 25.9,30.6 24.3,29 10.8,29 10.6,28.8 v10.6,25.5
N$34
  Top 0.305: Q2.3 18,40 23.4,40 25.1,41.7 27.6,41.7 D2.A | D2.A 29.6,43.6 31.6,45.6 OUT.2 | LED1.C 28.85,44.25 D2.A
N$35
  Top 0.153: Q3.P$1 12.65,35.4 14.15,33.45 IC2.2
N$37
  Top 0.305: Q2.1 15.8,41.35 R16.2 R15.1
N$38
  Top 0.305: R11.1 R12.2 15.6,44.75 Q1.1
N$39  (via drill 0.3)
  Top 0.153: IC2.3 12.88,33.85 10,33.85 9.85,34 9,34 6.6,36.4 6.6,37.6 6.8,37.8 v6.8,38.2
  Bottom 0.153: BATT100.+ 7.2,45 5.3,43.1 5.3,39.7 v6.8,38.2
N$40
  Top 0.153: IC3.P$6 13.9,16.1 15.8,16.1 15.8,20 13.9,20 IC3.P$12
N$41  (via drill 0.3)
  Top 0.153: R12.1 13.7,43.05 14.65,44 16.85,44 16.9,43.95 16.9,38.8 16.7,38.6 15.65,38.6 14.55,37.6 13.55,37.6 v13.25,37.3
  Bottom 0.153: v13.25,37.3 12.9,37.3 11.65,36.05 10.7,36.05 8.95,34.4 7.2,34.4 3.6,30.9 3.6,22.7 6.6,19.8 13.8,19.8 15.4,18.2 15.4,8.5 16.6,7.1 20.7,7.1 21.3,6.4 21.3,1.9 20.9,1.6 19.45,1.6 18.75,2.4 18.75,3.35 18.05,4.05 18.05,4.74 U$7.13
RX  (via drill 0.3)
  Top 0.153: v20.5,19 20.05,19.35 20.05,21.65 18.95,22.8 18.95,24.65 19.2,24.9 19.95,24.9 20.2,25.2 20.2,30.7 IC1.5
  Bottom 0.153: U$7.10 22.6,3.5 23.8,4.7 23.8,7.3 20.1,11 20.1,18.9 v20.5,19
SCLK  (via drill 0.3)
  Top 0.153: 4.85,4.8 U$7.23
  Top 0.2: IC3.P$25 6.35,14.9 v4.85,13.4 4.85,4.8
  Bottom 0.2: SPI.4 2.9,13.4 v4.85,13.4
TX  (via drill 0.3)
  Top 0.153: v21.05,21.55 21.05,24.8 20.7,25.15 20.7,31.2 IC1.4
  Bottom 0.153: U$7.8 25.14,3.24 26.4,4.5 26.4,7.2 22.7,10.9 22.7,21.1 22.3,21.55 v21.05,21.55 21.05,21.6
VCC  (via drill 0.3)
  Top 0.153: R25.2 10.1,7.62 10.1,6.7 22.55,6.7 IC4.1 24.3,7.7 24.3,8.7 24.5,8.9 27.6,8.9 27.8,8.7 27.8,7.7 C10.1 | R21.1 9.53,22.88 v9.45,22.9 | IC1.3 18.9,31.7 18.9,33.3 18.68,33.53 18.68,33.72 C1.1 18.7,33.5 v17.6,33.5 17.55,33.45 IC1.1
  Top 0.305: R21.1 10.55,24.05 10.7,24.2 18.5,24.2 18.5,22.4 19.4,21.5 19.4,11.4 20.9,9.9 21.9,9.9 22.5,9.3 22.5,8.4 23.2,7.7 IC4.1
  Bottom 0.153: v9.45,22.9 9.45,25.15 9.1,25.5 9.1,28.9 10.3,30.1 18.1,30.1 18.7,30.7 18.7,33.5 v17.6,33.5

### Text on the board
tPlace: rev4